# EAGLE design PrimaryBoard (EAGLE 9.6.2)
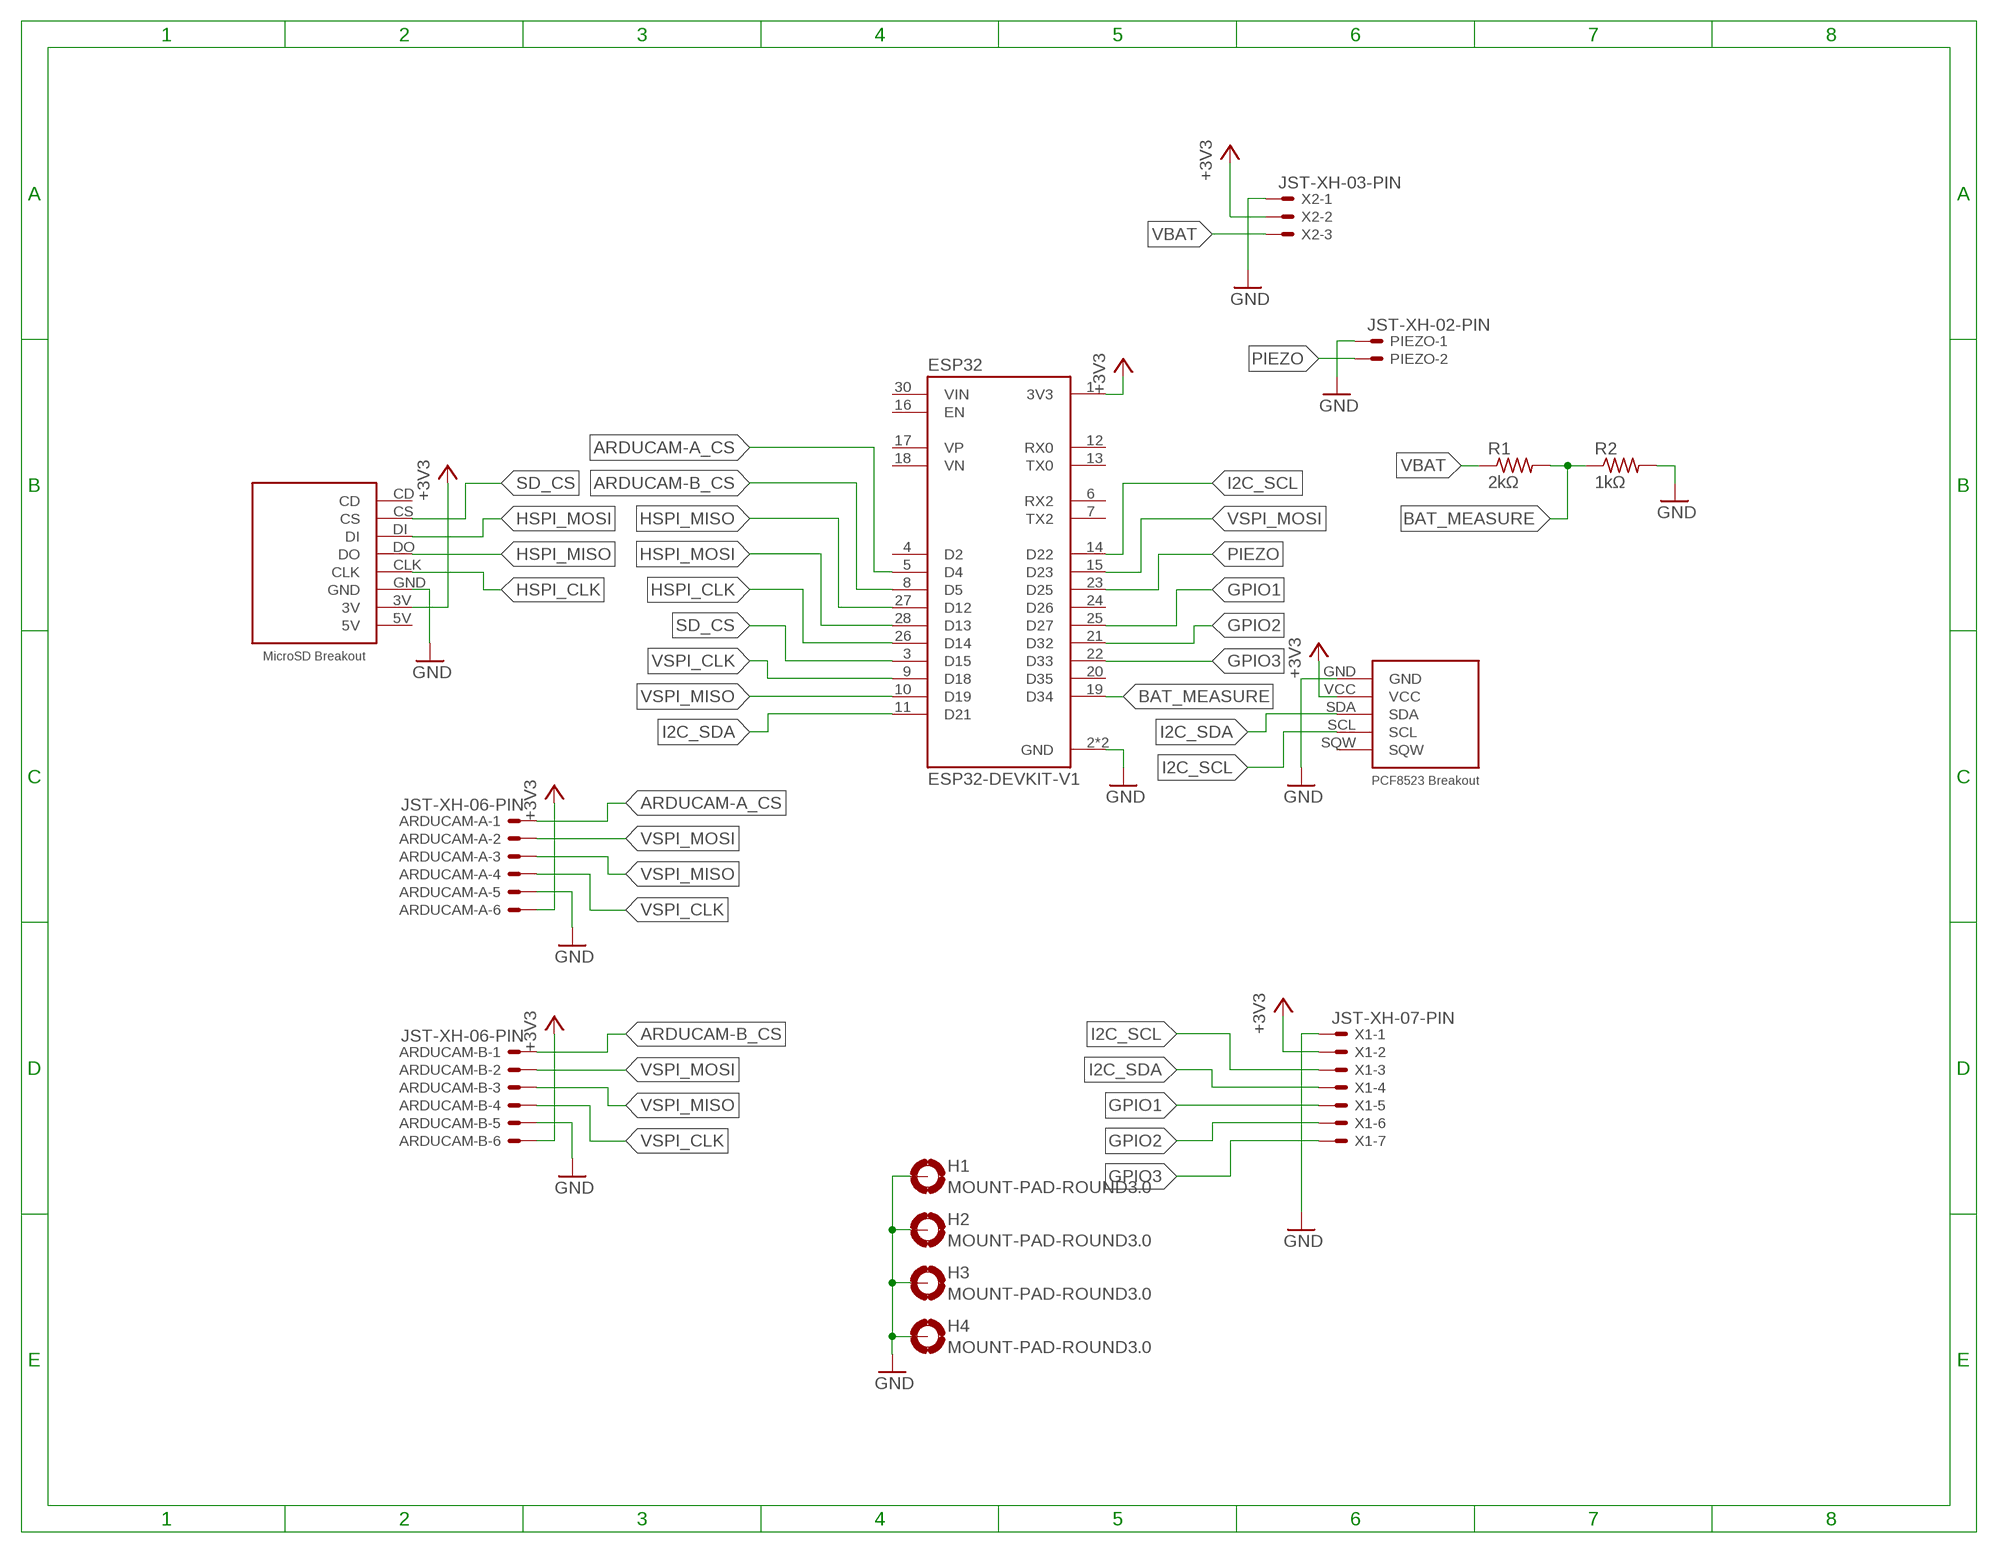
[diagram p0: schematic, sheet 1]

## Parts
ARDUCAM-A  JST-XH-06-PIN  [JST-XH_S6B]
ARDUCAM-B  JST-XH-06-PIN  [JST-XH_S6B]
ESP32  ESP32-DEVKIT-V1  [MODULE_ESP32_DEVKIT_V1]
H1  MOUNT-PAD-ROUND3.0  [3,0-PAD]
H2  MOUNT-PAD-ROUND3.0  [3,0-PAD]
H3  MOUNT-PAD-ROUND3.0  [3,0-PAD]
H4  MOUNT-PAD-ROUND3.0  [3,0-PAD]
PIEZO  JST-XH-02-PIN  [JST-XH_S2B]
R1  2kΩ  R-US_0207/10  [0207/10]
R2  1kΩ  R-US_0207/10  [0207/10]
U$1  MICROSDBREAKOUT5V  [MICROSDBREAKOUT5V]
U$2  PCF8523BREAKOUT  [PCF8523BREAKOUT]
X1  JST-XH-07-PIN  [JST-XH_S7B]
X2  JST-XH-03-PIN  [JST-XH_S3B]

## Nets
+3V3 [power]: ARDUCAM-A.PIN6 ARDUCAM-B.PIN6 ESP32.1(3V3) U$1.3V U$2.VCC X1.PIN2 X2.PIN2
ARDUCAM-A_CS: ARDUCAM-A.PIN1 ESP32.5(D4)
ARDUCAM-B_CS: ARDUCAM-B.PIN1 ESP32.8(D5)
BAT_MEASURE: ESP32.19(D34) R1.2 R2.1
GND [power]: ARDUCAM-A.PIN5 ARDUCAM-B.PIN5 ESP32.2(GND) ESP32.29(GND) H1.B3,0(MOUNT) H2.B3,0(MOUNT) H3.B3,0(MOUNT) H4.B3,0(MOUNT) PIEZO.PIN1 R2.2 U$1.GND U$2.GND X1.PIN1 X2.PIN1
GPIO1: ESP32.25(D27) X1.PIN5
GPIO2: ESP32.21(D32) X1.PIN6
GPIO3: ESP32.22(D33) X1.PIN7
HSPI_CLK: ESP32.26(D14) U$1.CLK
HSPI_MISO: ESP32.27(D12) U$1.DO
HSPI_MOSI: ESP32.28(D13) U$1.DI
I2C_SCL: ESP32.14(D22) U$2.SCL X1.PIN3
I2C_SDA: ESP32.11(D21) U$2.SDA X1.PIN4
PIEZO: ESP32.23(D25) PIEZO.PIN2
SD_CS: ESP32.3(D15) U$1.CS
VBAT: R1.1 X2.PIN3
VSPI_CLK: ARDUCAM-A.PIN4 ARDUCAM-B.PIN4 ESP32.9(D18)
VSPI_MISO: ARDUCAM-A.PIN3 ARDUCAM-B.PIN3 ESP32.10(D19)
VSPI_MOSI: ARDUCAM-A.PIN2 ARDUCAM-B.PIN2 ESP32.15(D23)
Unconnected: ESP32.4(D2) ESP32.6(RX2) ESP32.7(TX2) ESP32.12(RX0) ESP32.13(TX0) ESP32.16(EN) ESP32.17(VP) ESP32.18(VN) ESP32.20(D35) ESP32.24(D26) ESP32.30(VIN) U$1.5V U$1.CD U$2.SQW

## Library data of the parts
ARDUCAM-A ARDUCAM-B = JST-XH Connectors:JST-XH-06-PIN: JST XH Connector 2 Pin Wire to board connector. Pitch: 2,54 mm, (0.100") Number of pins: 6 Created by Rembrandt Electronics www.rembrandtelectronics.com
ESP32 = ESP32-DEVKIT-V1:ESP32-DEVKIT-V1: Dual core, Wi-Fi: 2.4 GHz up to 150 Mbits/s,BLE (Bluetooth Low Energy) and legacy Bluetooth, 32 bits, Up to 240 MHz Check availability <https://pricing.snapeda.com/parts/ESP32-DEVKIT-V1/Do%20it/view-part?ref=eda>; AVAILABILITY: Not in stock; CHECK_PRICES: https://www.snapeda.com/parts/ESP32-DEVKIT-V1/Do+it/view-part/?ref=eda; DESCRIPTION: Dual core, Wi-Fi: 2.4 GHz up to 150 Mbits/s,BLE (Bluetooth Low Energy) and legacy Bluetooth, 32 bits, Up to 240 MHz; MF: Do it; MP: ESP32-DEVKIT-V1; PACKAGE: None; PRICE: None; SNAPEDA_LINK: https://www.snapeda.com/parts/ESP32-DEVKIT-V1/Do+it/view-part/?ref=snap
H1-H4 = holes:MOUNT-PAD-ROUND: MOUNTING PAD, round
PIEZO = JST-XH Connectors:JST-XH-02-PIN: JST XH Connector 2 Pin Wire to board connector. Pitch: 2,54 mm, (0.100") Number of pins: 2 Created by Rembrandt Electronics www.rembrandtelectronics.com
R1 R2 = rcl:R-US_: RESISTOR, American symbol; SPICEPREFIX: R
U$1 = Breakouts:MICROSDBREAKOUT5V
U$2 = Breakouts:PCF8523BREAKOUT: Adafruit PCF8523 Real Time Clock Assembled Breakout Board https://www.adafruit.com/product/3295
X1 = JST-XH Connectors:JST-XH-07-PIN: JST XH Connector 2 Pin Wire to board connector. Pitch: 2,54 mm, (0.100") Number of pins: 7 Created by Rembrandt Electronics www.rembrandtelectronics.com
X2 = JST-XH Connectors:JST-XH-03-PIN: JST XH Connector 2 Pin Wire to board connector. Pitch: 2,54 mm, (0.100") Number of pins: 3 Created by Rembrandt Electronics www.rembrandtelectronics.com

## Net classes
1 power: width 0.5 mm

## Board
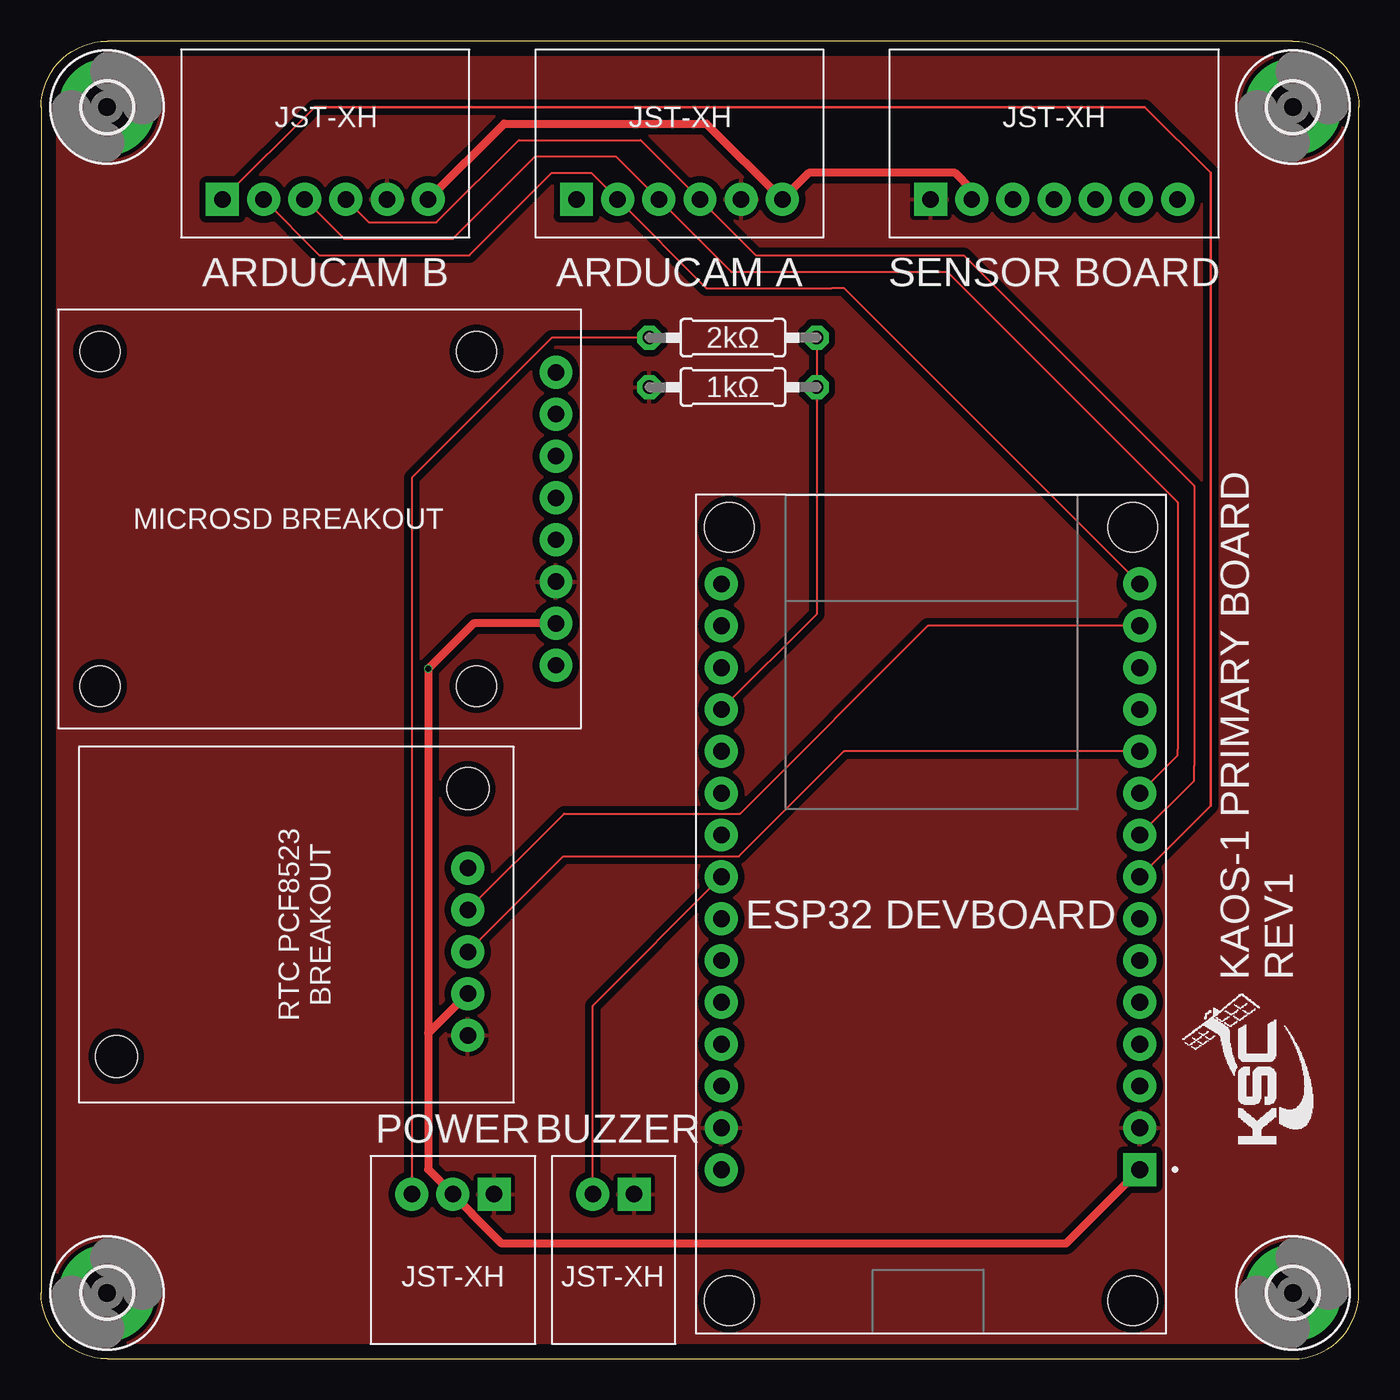
[diagram p1: board, top side]
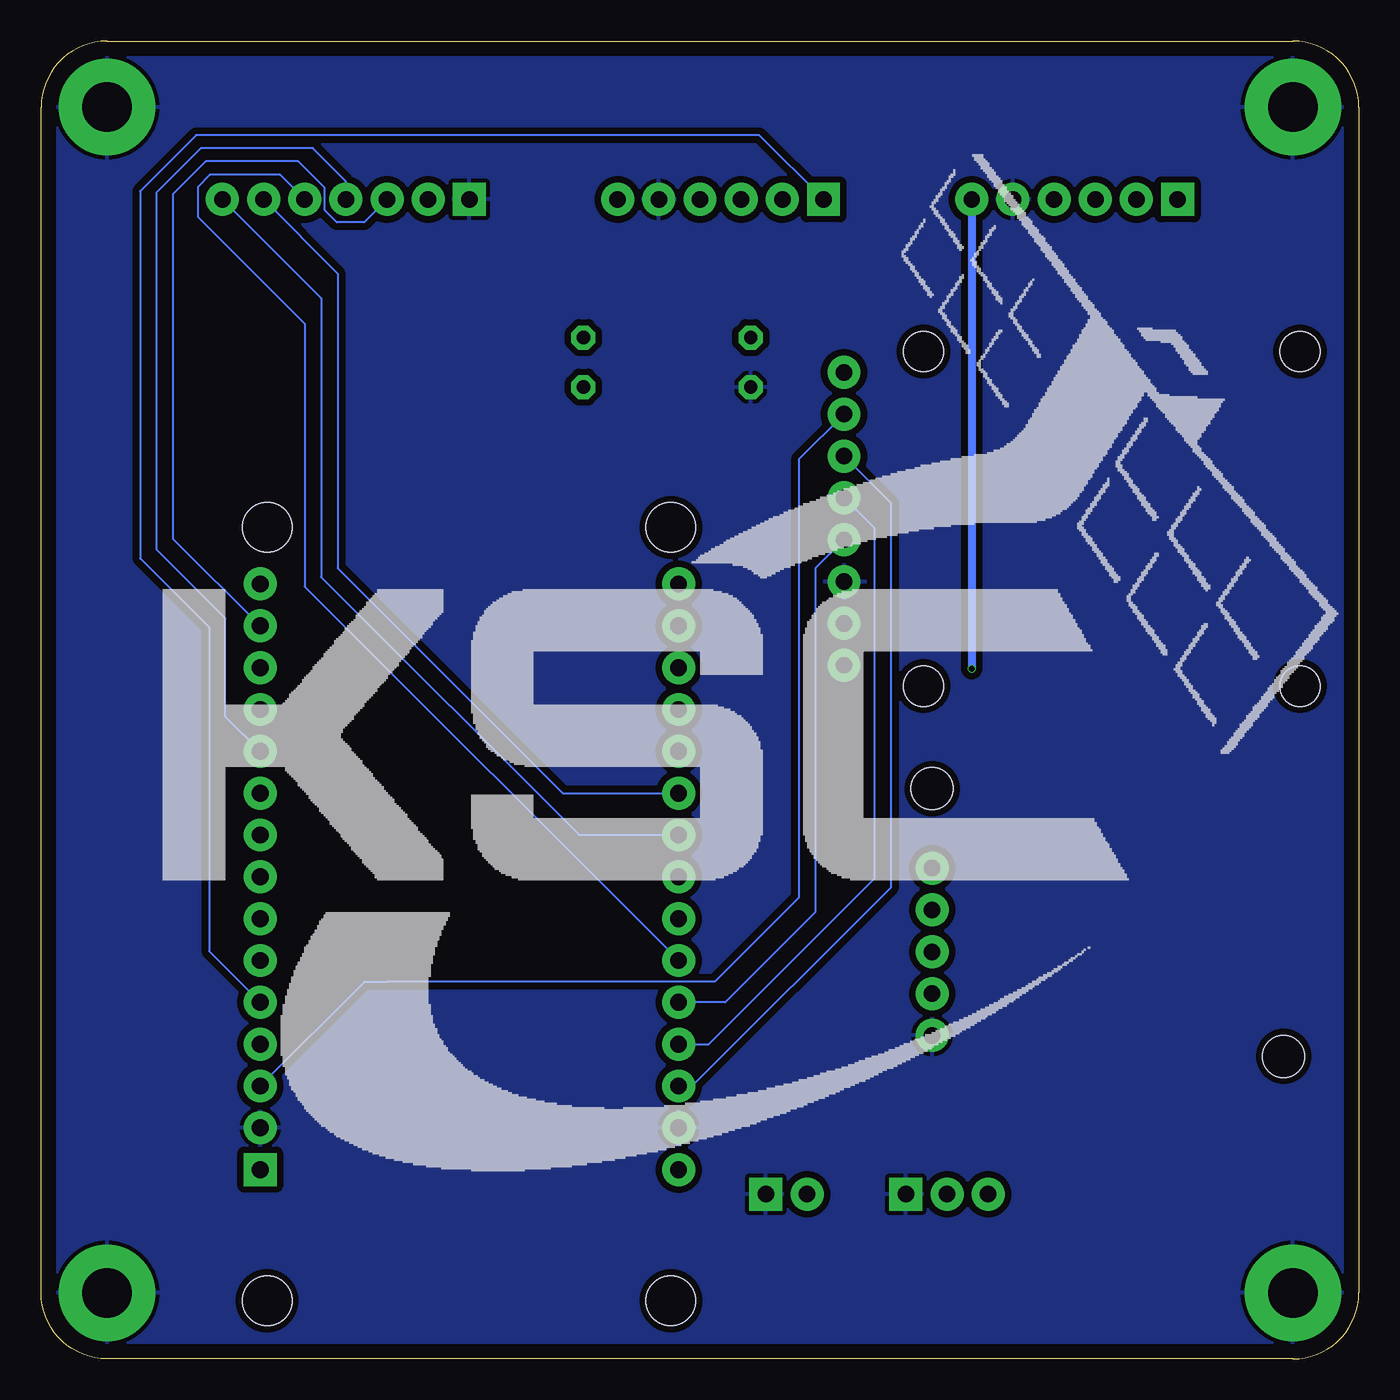
[diagram p2: board, bottom side, seen from below]

Size 80 x 80 mm. Coordinates in mm from the lower left corner, seen from the top.
Outline: 4,0 76,0 arc90 80,4 80,76 arc90 76,80 4,80 arc90 0,76 0,4 arc90 4,0
Copper layers (1*16): Top 0.035mm / dielectric 1.6mm / Bottom 0.035mm
Design rules "jlcpcb-2layers": minimum track width 5mil, minimum drill 0.3mm, track to track 5mil, track to pad 5mil, pad to pad 5mil, via to via 5mil, smd to smd 5mil, copper to edge 0.2mm, drill to drill 6mil, minimum pad ring 10mil, minimum via ring 3mil, stop-mask expansion 4mil, vias tented up to drill 0mil, thermal gap 10mil

### Footprints (pad centres in the part's own frame; a part is rotated, then mirrored left to right if it is on the bottom)
JST-XH_S6B = drill 1 pad 2 square: PIN1 0,0 | drill 1 pad 2: PIN2 2.5,0; PIN3 5,0; PIN4 7.5,0; PIN5 10,0; PIN6 12.5,0
MODULE_ESP32_DEVKIT_V1 = drill 1.02 pad 2 square: 1 -12.7,15.515 | drill 1.02 pad 2: 2 -12.7,12.975; 3 -12.7,10.435; 4 -12.7,7.895; 5 -12.7,5.355; 6 -12.7,2.815; 7 -12.7,0.275; 8 -12.7,-2.265; 9 -12.7,-4.805; 10 -12.7,-7.345; 11 -12.7,-9.885; 12 -12.7,-12.425; 13 -12.7,-14.965; 14 -12.7,-17.505; 15 -12.7,-20.045; 16 12.7,-20.045; 17 12.7,-17.505; 18 12.7,-14.965; 19 12.7,-12.425; 20 12.7,-9.885; 21 12.7,-7.345; 22 12.7,-4.805; 23 12.7,-2.265; 24 12.7,0.275; 25 12.7,2.815; 26 12.7,5.355; 27 12.7,7.895; 28 12.7,10.435; 29 12.7,12.975; 30 12.7,15.515 | hole 3: -12.28,-23.475; 12.23,-23.475; 12.23,23.475; -12.28,23.475
3,0-PAD = drill 3 pad 5.842: B3,0 0,0
JST-XH_S2B = drill 1 pad 2 square: PIN1 0,0 | drill 1 pad 2: PIN2 2.5,0
0207/10 = drill 0.813 octagon: 1 -5.08,0; 2 5.08,0
MICROSDBREAKOUT5V = drill 1 pad 2: 3V 16.256,-6.35; 5V 16.256,-8.89; CD 16.256,8.89; CLK 16.256,-1.27; CS 16.256,6.35; DI 16.256,3.81; DO 16.256,1.27; GND 16.256,-3.81 | hole 2.438: 11.43,10.16; -11.43,-10.16; -11.43,10.16; 11.43,-10.16
PCF8523BREAKOUT = drill 1 pad 2: GND -7.366,-9.906; SCL 0.254,-9.906; SDA -2.286,-9.906; SQW 2.794,-9.906; VCC -4.826,-9.906 | hole 2.54: 7.62,-9.906; -8.636,11.43
JST-XH_S7B = drill 1 pad 2 square: PIN1 0,0 | drill 1 pad 2: PIN2 2.5,0; PIN3 5,0; PIN4 7.5,0; PIN5 10,0; PIN6 12.5,0; PIN7 15,0
JST-XH_S3B = drill 1 pad 2 square: PIN1 0,0 | drill 1 pad 2: PIN2 2.5,0; PIN3 5,0

### Placement (x,y rotation side)
ARDUCAM-A  32.5,70.39 0 top
ARDUCAM-B  11,70.39 0 top
ESP32  54,27 180 top
H1  76,4 0 top
H2  76,76 0 top
H3  4,4 0 top
H4  4,76 0 top
PIEZO  36,10 180 top
R1  42,62 0 top
R2  42,59 180 top
U$1  15,51 0 top
U$2  16,27 90 top
X1  54,70.39 0 top
X2  27.5,10 180 top

### Tracks (layer width: path | path; a pad name or v marks a point on that pad's centre or on a via)
+3V3  (via drill 0.35)
  Top 0.5: ARDUCAM-B.PIN6 28.11,75 40.39,75 ARDUCAM-A.PIN6 46.61,72 55.49,72 56.5,70.99 X1.PIN2 | 23.5,19.77 v23.5,41.9 26.25,44.65 U$1.3V | 23.5,19.77 23.5,11.5 X2.PIN2 26.12,8.88 26.12,8.84 27.97,7 62.22,7 ESP32.1 | U$2.VCC 23.5,19.77
  Bottom 0.5: ARDUCAM-B.PIN6 v23.5,41.9
ARDUCAM-A_CS
  Bottom 0.127: ARDUCAM-A.PIN1 36.41,74.3 70.6,74.3 74,70.9 74,48.6 69.81,44.41 69.81,24.75 ESP32.5
ARDUCAM-B_CS
  Top 0.152: ARDUCAM-B.PIN1 16.61,76 67,76 71,72 71,33.56 ESP32.8
BAT_MEASURE
  Top 0.127: R1.2 R2.1 47.08,45.2 ESP32.19
GND
  pour Top (isolate 0.4): 1,1 1,79 79,79 79,1
  pour Bottom (isolate 0.4): 1,1 1,79 79,79 79,1
GPIO1
  Bottom 0.127: X1.PIN5 65.49,71.88 69.75,71.88 70.49,71.14 70.49,69.34 64,62.85 64,46.88 ESP32.25
GPIO2
  Bottom 0.127: X1.PIN6 62,65.89 62,48.01 48.34,34.34 ESP32.21
GPIO3
  Bottom 0.127: X1.PIN7 63,64.39 63,47.47 47.34,31.8 ESP32.22
HSPI_CLK
  Bottom 0.127: U$1.CLK 33,47.99 33,27.12 38.48,21.64 ESP32.26
HSPI_MISO
  Bottom 0.127: U$1.DO 29.4,50.41 29.4,29.18 39.48,19.11 ESP32.27
HSPI_MOSI
  Bottom 0.127: U$1.DI 28.4,51.95 28.4,28.64 40.48,16.57 ESP32.28
I2C_SCL
  Top 0.127: U$2.SCL 31.75,33.1 42.44,33.1 53.84,44.51 ESP32.14
  Bottom 0.127: X1.PIN3 60.39,69 62.05,69 62.79,69.74 62.79,71.09 64.4,72.7 70,72.7 72,70.7 72,49.8 ESP32.14
I2C_SDA
  Top 0.127: U$2.SDA 31.69,30.5 42.35,30.5 48.74,36.88 ESP32.11
  Bottom 0.127: X1.PIN4 61.5,71.49 63.51,73.5 70.3,73.5 73,70.8 73,49.15 68.81,44.95 68.81,38.99 ESP32.11
PIEZO
  Top 0.127: PIEZO.PIN2 33.5,21.43 ESP32.23
SD_CS
  Bottom 0.127: U$1.CS 34,54.61 34,28 39.1,22.9 59,22.9 60.37,22.9 ESP32.3
VBAT
  Top 0.127: R1.1 31,62 22.5,53.5 X2.PIN3
VSPI_CLK
  Top 0.127: ARDUCAM-B.PIN4 19.89,69 24,69 29,74 36.39,74 ARDUCAM-A.PIN4 43.39,67 56,67 70,53 70,36 70,35.1 ESP32.9
VSPI_MISO
  Top 0.127: ARDUCAM-B.PIN3 18.39,68 25,68 30,73 34.89,73 ARDUCAM-A.PIN3 41.89,66 55,66 69,52 69,37 69,36.65 ESP32.10
VSPI_MOSI
  Top 0.127: ARDUCAM-B.PIN2 16.89,67 26,67 31,72 33.39,72 ARDUCAM-A.PIN2 40.39,65 48,65 48.74,65 ESP32.15

### Text on the board
tPlace: ARDUCAM B | ARDUCAM A | SENSOR BOARD | ESP32 DEVBOARD | KAOS-1 PRIMARY BOARD / REV1 | POWER | BUZZER